# Altium schematic sheet STM32.SchDoc
size 317 x 200 mm; SheetNumber: 1; SheetTotal: 2
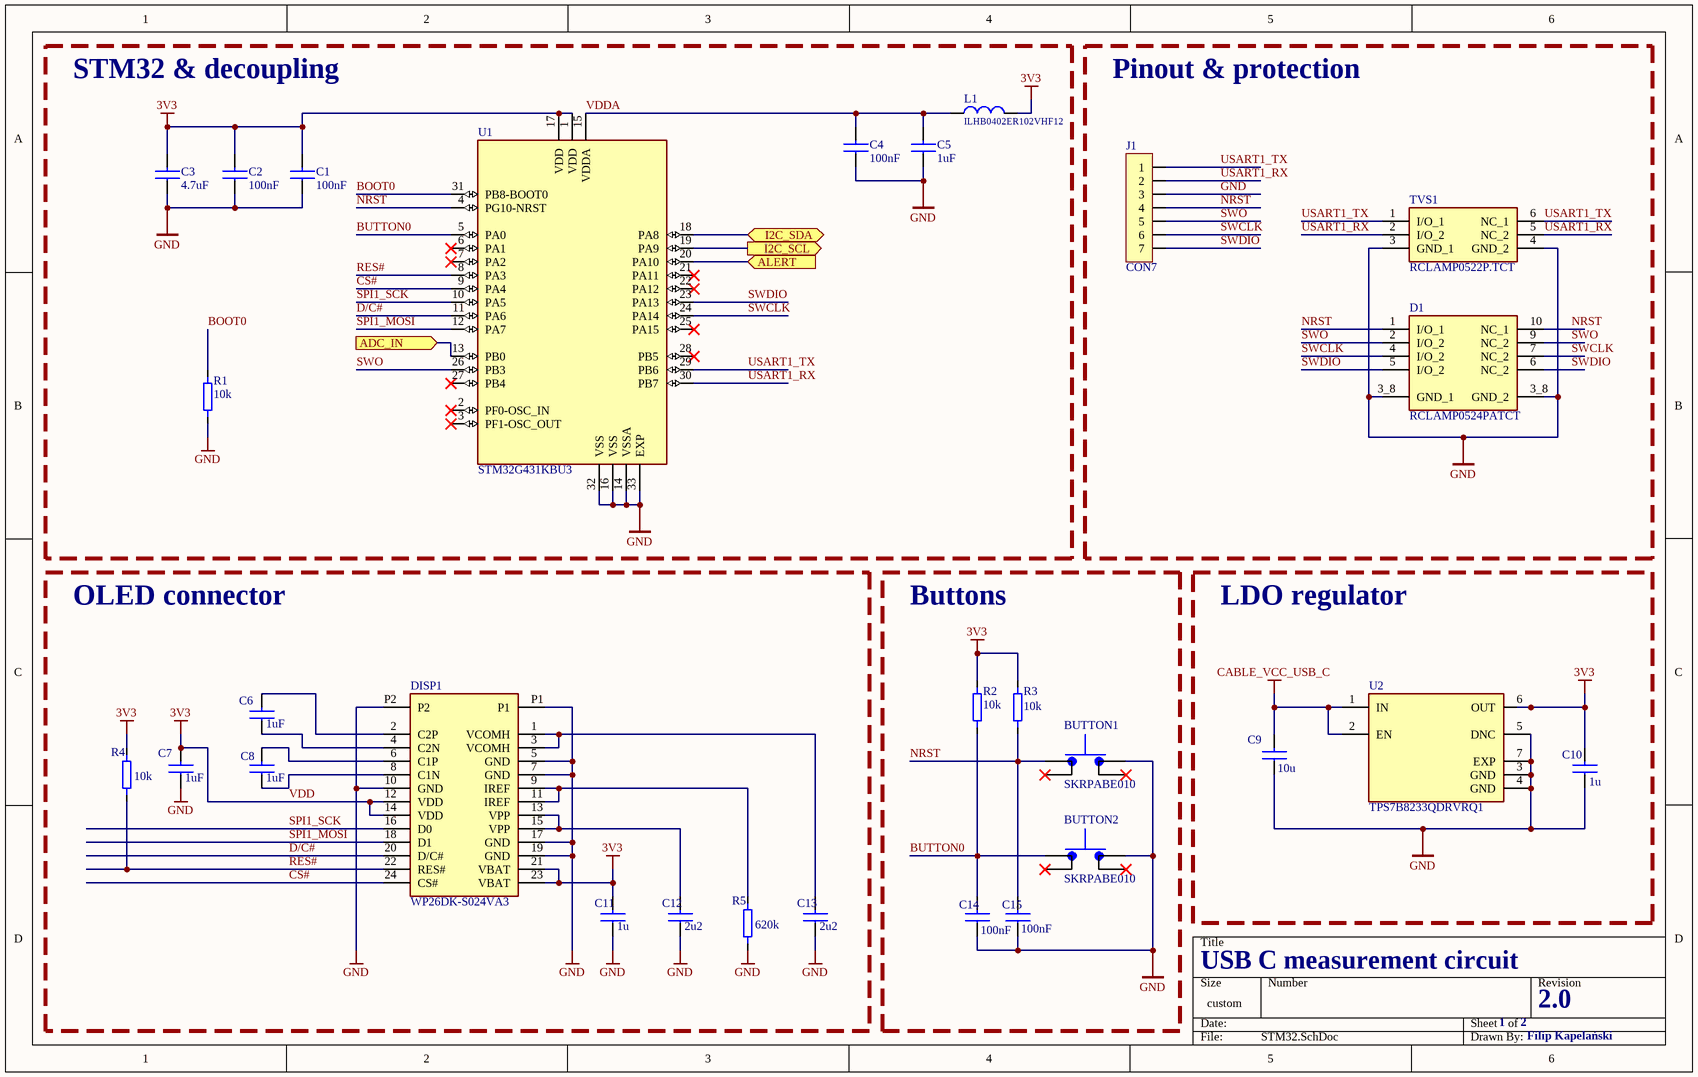
[diagram p0: STM32.SchDoc]

## Parts
BUTTON1  SKRPABE010  [SKRPABE010]
BUTTON2  SKRPABE010  [SKRPABE010]
C1  100nF  [C0402]
C2  100nF  [C0402]
C3  4.7uF  [C0402]
C4  100nF  [C0402]
C5  1uF  [C0402]
C6  1uF  [C0402]
C7  1uF  [C0402]
C8  1uF  [C0402]
C9  10u  [C0402]
C10  1u  [C0402]
C11  1u  [C0402]
C12  2u2  [C0402]
C13  2u2  [C0402]
C14  100nF  [C0402]
C15  100nF  [C0402]
D1  RCLAMP0524PATCT  [DIO_RCLAMP0524PATCT]
DISP1  WP26DK-S024VA3  [WP26DK-S024VA3]
J1  CON7  [SIP7]
L1  ILHB0402ER102VHF12  [L0402]
R1  10k  [R0402]
R2  10k  [R0402]
R3  10k  [R0402]
R4  10k  [R0402]
R5  620k  [R0402]
TVS1  RCLAMP0522P.TCT  [RCLAMP0522PTCT]
U1  STM32G431KBU3  [STM32G431KBU3]
U2  TPS7B8233QDRVRQ1  [TPS7B8233QDRVRQ1]

## Blocks framed on the sheet
STM32 & decoupling: C1-C5 L1 R1 U1
Pinout & protection: D1 J1 TVS1
OLED connector: C6-C8 C11-C13 DISP1 R4 R5
Buttons: BUTTON1 BUTTON2 C14 C15 R2 R3
LDO regulator: C9 C10 U2

## Ports
ADC_IN (in, see MeasurementCircuit[3A]), ALERT (in, see MeasurementCircuit[3D]), I2C_SCL (out, see MeasurementCircuit[1D]), I2C_SDA (bidir, see MeasurementCircuit[1D])

## Nets
CABLE_VCC_USB_C: C9.2 U2.1(IN) U2.2(EN)
GND: BUTTON1.3 BUTTON2.3 C1.1 C2.1 C3.1 C4.1 C5.1 C7.1 C9.1 C10.1 C11.1 C12.1 C13.1 C14.1 C15.1 D1.3_8(GND_1) DISP1.5(GND) DISP1.7(GND) DISP1.10(GND) DISP1.17(GND) DISP1.19(GND) DISP1.P1 DISP1.P2 J1.3 R1.1 R5.2 TVS1.3(GND_1) TVS1.4(GND_2) U1.14(VSSA) U1.16(VSS) U1.32(VSS) U1.33(EXP) U2.3(GND) U2.4(GND) U2.5(DNC) U2.7(EXP)
VDD: C1.2 C2.2 C3.2 C7.2 C10.2 C11.2 DISP1.12(VDD) DISP1.14(VDD) DISP1.21(VBAT) DISP1.23(VBAT) L1.1 R2.1 R3.1 R4.1 U1.1(VDD) U1.17(VDD) U2.6(OUT)  [also labelled 3V3]
ADC_IN: U1.13(PB0) ; port ADC_IN
ALERT: U1.20(PA10) ; port ALERT
BOOT0: R1.2 U1.31(PB8-BOOT0)
BUTTON0: BUTTON2.1 C14.2 R2.2 U1.5(PA0)
CS#: DISP1.24(CS#) U1.9(PA4)
D/C#: DISP1.20(D/C#) U1.11(PA6)
I2C_SCL: U1.19(PA9) ; port I2C_SCL
I2C_SDA: U1.18(PA8) ; port I2C_SDA
NRST: BUTTON1.1 C15.2 D1.1(I/O_1) D1.10(NC_1) J1.4 R3.2 U1.4(PG10-NRST)
RES#: DISP1.22(RES#) R4.2 U1.8(PA3)
SPI1_MOSI: DISP1.18(D1) U1.12(PA7)
SPI1_SCK: DISP1.16(D0) U1.10(PA5)
SWCLK: D1.4(I/O_2) D1.7(NC_2) J1.6 U1.24(PA14)
SWDIO: D1.5(I/O_2) D1.6(NC_2) J1.7 U1.23(PA13)
SWO: D1.2(I/O_2) D1.9(NC_2) J1.5 U1.26(PB3)
USART1_RX: J1.2 TVS1.2(I/O_2) TVS1.5(NC_2) U1.30(PB7)
USART1_TX: J1.1 TVS1.1(I/O_1) TVS1.6(NC_1) U1.29(PB6)
VDDA: C4.2 C5.2 L1.2 U1.15(VDDA)
NetC6_1: C6.1 DISP1.4(C2N)
NetC6_2: C6.2 DISP1.2(C2P)
NetC8_1: C8.1 DISP1.8(C1N)
NetC8_2: C8.2 DISP1.6(C1P)
NetC12_2: C12.2 DISP1.13(VPP) DISP1.15(VPP)
NetC13_2: C13.2 DISP1.1(VCOMH) DISP1.3(VCOMH)
NetDISP1_9: DISP1.9(IREF) DISP1.11(IREF) R5.1

Not connected (* = marked no-connect by the designer): BUTTON1 2(1)* 4(2)*; BUTTON2 2(1)* 4(2)*; U1 2(PF0-OSC_IN)* 3(PF1-OSC_OUT)* 6(PA1)* 7(PA2)* 21(PA11)* 22(PA12)* 25(PA15)* 27(PB4)* 28(PB5)*

## Notes on the sheet
- USB C measurement circuit
- 1
- 2
- 2.0
- Filip Kapelański

## Library data of the parts
BUTTON1 BUTTON2 = SKRPABE010: Switch Tactile N.O. SPST Button J-Bend 0.05A 16VDC 1.57N SMD Automotive T/R
C1-C15 = C: Kondensator ceramiczny SMD; Supplier: *; SupplierURL: *; helpurl: *; Manufacturer: *; PartNumber: *; Price: *; Symbol: *; Package: *; Voltage: *
  C1 C2 C4 C14 C15: Value: 100nF
  C3: Value: 4.7uF
  C5-C8: Value: 1uF
  C9: Value: 10u
  C10 C11: Value: 1u
  C12 C13: Value: 2u2
D1 = RCLAMP0524PATCT: 15V Clamp 5A (8/20Âµs) Ipp Tvs Diode Surface Mount SLP2510P8; MF: Semtech Corporation; SnapEDA_Link: https://www.snapeda.com/parts/RCLAMP0524PATCT/Semtech+Corporation/view-part/?ref=snap; Package: UFDFN-10 Semtech; Value: *; MP: RCLAMP0524PATCT; Check_prices: https://www.snapeda.com/parts/RCLAMP0524PATCT/Semtech+Corporation/view-part/?ref=eda
J1 = CON7: Connector
L1 = L: Cewka/Koralik ferrytowy; Supplier: *; SupplierURL: *; helpurl: *; Manufacturer: *; Package: *; PartNumber: *; Price: *; Symbol: *; Value: ILHB0402ER102VHF12
R1-R5 = R: Rezystor SMD; helpurl: *; Manufacturer: *; PartNumber: *; Price: *; Symbol: *; Package: *; Supplier: *; SupplierURL: *
  R1-R4: Value: 10k
  R5: Value: 620k
TVS1 = RCLAMP0522P.TCT: TVS Diode (Bi-directional); Manufacturer_Name: SEMTECH; Datasheet Link: https://www.digikey.ph/en/products/detail/semtech-corporation/RCLAMP0522P-TCT/5113632; Height: 0.65mm; Manufacturer_Part_Number: RCLAMP0522P.TCT; Mouser Part Number: 947-RCLAMP0522P.TCT; Mouser Price/Stock: https://www.mouser.co.uk/ProductDetail/Semtech/RCLAMP0522P.TCT?qs=rBWM4%252BvDhIdKBWbIaH8MsA%3D%3D; Arrow Part Number: RCLAMP0522P.TCT; Arrow Price/Stock: https://www.arrow.com/en/products/rclamp0522p.tct/semtech?utm_currency=USD&region=nac
U1 = STM32G431KBU3: ARM® Cortex®-M4F STM32G4 Microcontroller IC 32-Bit Single-Core 170MHz 128KB (128K x 8) FLASH 32-UFQFPN (5x5); ComponentLink1Description: New link; ComponentLink1URL: https://www.mouser.pl/ProductDetail/STMicroelectronics/STM32G431KBU3?qs=PzGy0jfpSMtowkKWTRQBRw%3D%3D
U2 = TPS7B8233QDRVRQ1: WSON-6, Automotive 300-mA, off-battery (40-V), ultra-low-IQ LDO with enable in AEC-Q100 Grade-0 and Grade-1